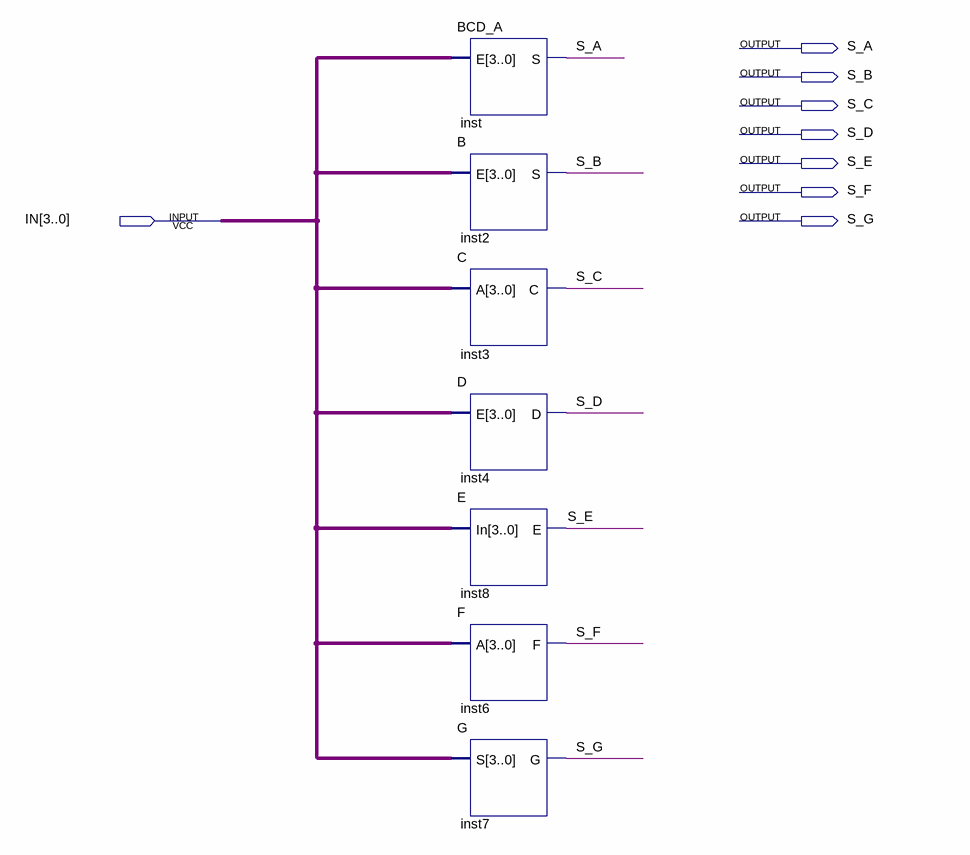
[diagram p0: schematic sheet]
// Quartus schematic CONVERSOR_BCD.bdf as structural Verilog: 7 symbols, 8 pins
module CONVERSOR_BCD (
  input  [3:0] IN,
  output S_A,
  output S_B,
  output S_C,
  output S_D,
  output S_E,
  output S_F,
  output S_G
);

  BCD_A inst (.E(IN), .S(S_A));
  B inst2 (.E(IN), .S(S_B));
  C inst3 (.A(IN), .C(S_C));
  D inst4 (.E(IN), .D(S_D));
  E inst8 (.In(IN), .E(S_E));
  F inst6 (.A(IN), .F(S_F));
  G inst7 (.S(IN), .G(S_G));
endmodule
